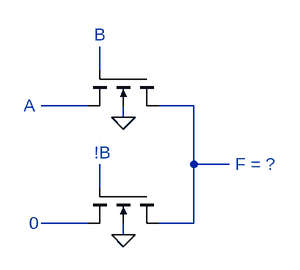
[diagram p0: schematic pass_logic_dummy.asc]
pass_logic_dummy.asc, the LTspice schematic file:
Version 4
SHEET 1 1292 680
WIRE -1312 -272 -1312 -304
WIRE -1328 -224 -1392 -224
WIRE -1184 -224 -1232 -224
WIRE -1280 -208 -1280 -224
WIRE -1184 -144 -1184 -224
WIRE -1136 -144 -1184 -144
WIRE -1312 -112 -1312 -144
WIRE -1328 -64 -1392 -64
WIRE -1184 -64 -1184 -144
WIRE -1184 -64 -1232 -64
WIRE -1280 -48 -1280 -64
FLAG -1280 -208 0
FLAG -1280 -48 0
SYMBOL nmos4 -1232 -272 R90
WINDOW 0 -7 -42 VRight 0
WINDOW 3 19 -78 VRight 0
SYMATTR Value ""
SYMBOL nmos4 -1232 -112 R90
WINDOW 0 72 -46 VRight 0
WINDOW 3 100 -77 VRight 0
SYMATTR Value ""
TEXT -1128 -144 Left 0 ;F = ?
TEXT -1416 -224 Left 0 ;A
TEXT -1320 -320 Left 0 ;B
TEXT -1320 -160 Left 0 ;!B
TEXT -1408 -64 Left 0 ;0
LINE Normal -1312 -176 -1312 -176
LINE Normal -1312 -176 -1312 -176
LINE Normal -1312 -176 -1312 -176

The netlist it stands for:
* pass_logic_dummy.asc
M§? N003 N001 N002 0
M§? N003 N004 N005 0
.model NMOS NMOS
.model PMOS PMOS
.lib standard.mos
* F = ?
* A
* B
* !B
* 0
.backanno
.end